# EAGLE design sanguino_better_644 (EAGLE 5.10)
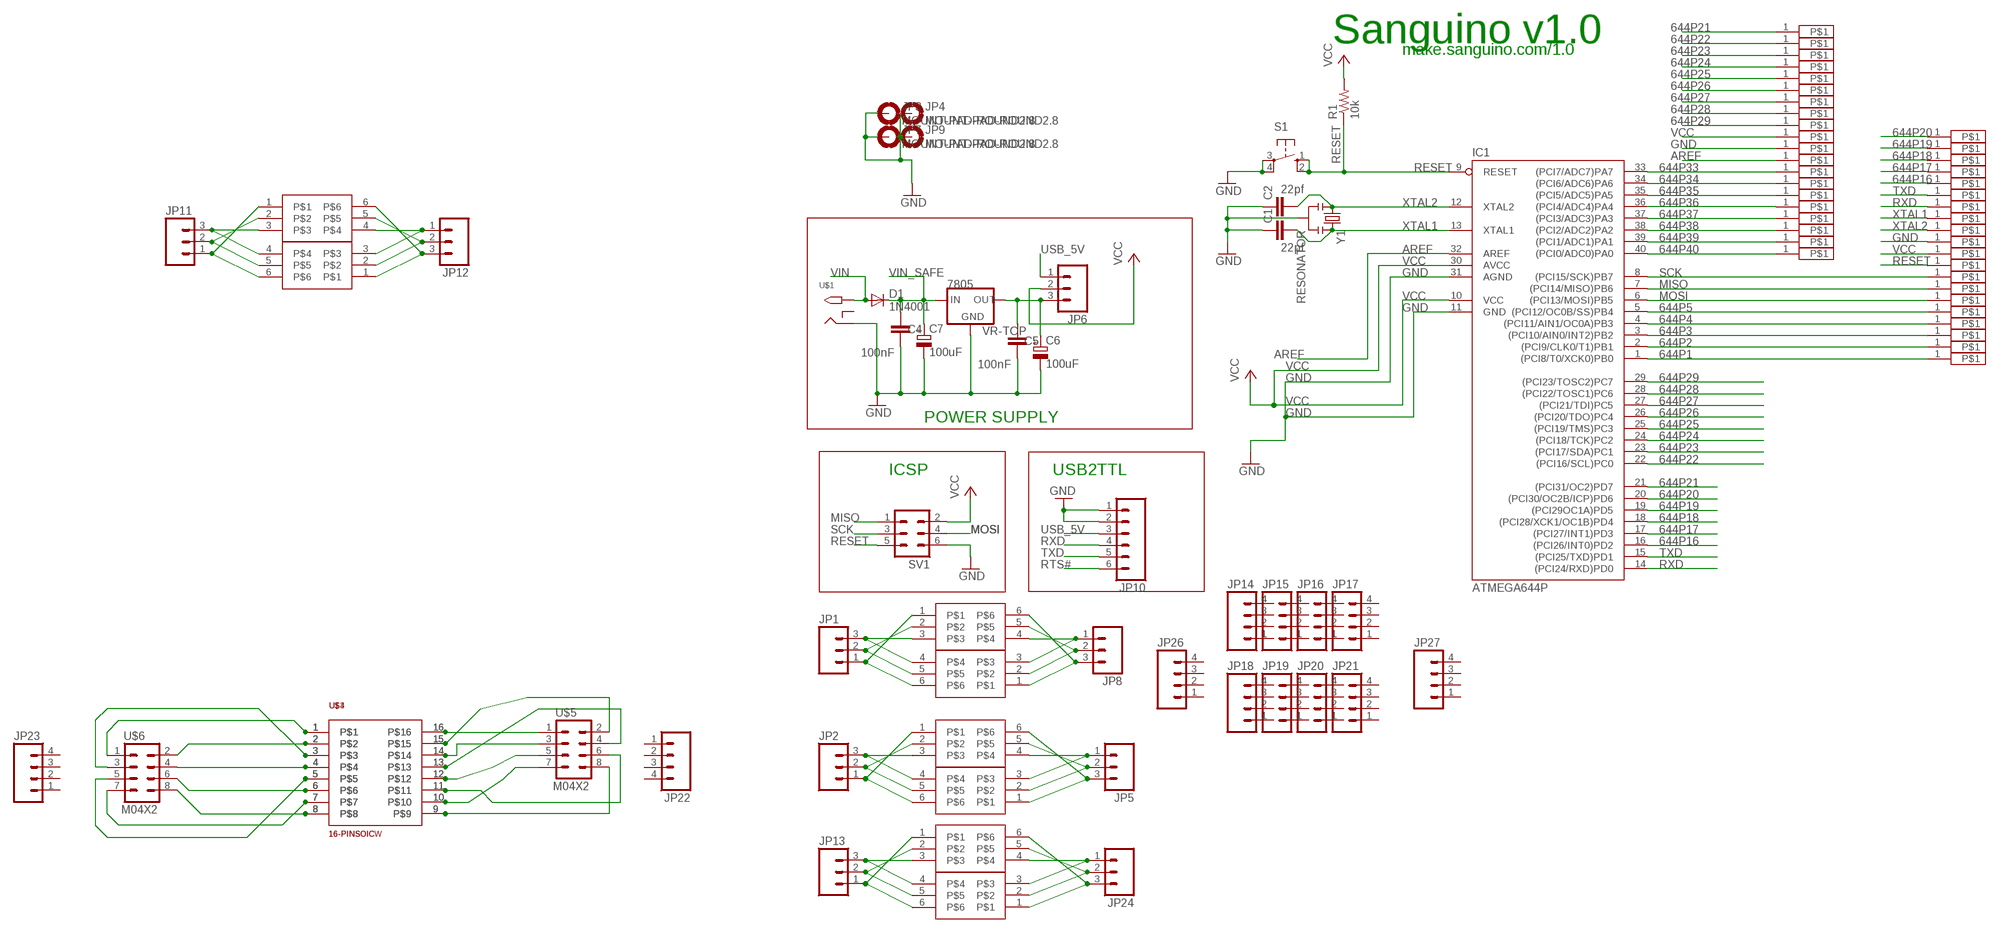
[diagram p0: schematic, sheet 1]

## Parts
C1  22pf  C-EU025-025X050  [C025-025X050]
C2  22pf  C-EU025-025X050  [C025-025X050]
C4  100nF  CAPPTH  [CAP-PTH-SMALL]
C5  100nF  CAPPTH  [CAP-PTH-SMALL]
C6  100uF  CPOL-EUE2.5-6  [E2,5-6]
C7  100uF  CPOL-EUE2.5-6  [E2,5-6]
D1  1N4001  1N4004  [DO41-10]
IC1  ATMEGA644P  ATMEGA644V-10P  [DIL40]
JP1  M03PTH  [1X03]
JP2  M03PTH  [1X03]
JP3  MOUNT-PAD-ROUND2.8  [2,8-PAD]
JP4  MOUNT-PAD-ROUND2.8  [2,8-PAD]
JP5  M03PTH  [1X03]
JP6  M03PTH  [1X03]
JP7  MOUNT-PAD-ROUND2.8  [2,8-PAD]
JP8  M03PTH  [1X03]
JP9  MOUNT-PAD-ROUND2.8  [2,8-PAD]
JP10  M06LOCK  [1X06_LOCK]
JP11  M03PTH  [1X03]
JP12  M03PTH  [1X03]
JP13  M03PTH  [1X03]
JP14  M04PTH  [1X04]
JP15  M04PTH  [1X04]
JP16  M04PTH  [1X04]
JP17  M04PTH  [1X04]
JP18  M04PTH  [1X04]
JP19  M04PTH  [1X04]
JP20  M04PTH  [1X04]
JP21  M04PTH  [1X04]
JP22  M04PTH  [1X04]
JP23  M04PTH  [1X04]
JP24  M03PTH  [1X03]
JP26  M04PTH  [1X04]
JP27  M04PTH  [1X04]
R1  10k  R-US_0207/2V  [0207/2V]
S1  10-XX  [B3F-10XX]
SV1  ML6  [ML6]
U$1  2.1MMJACKTHM  [PJ-102A]
U$2  3-PIN-STRIP  [1X03-STRIP]
U$3  16-PINSOICW  [SO16W]
U$4  16-PINSOIC  [SO16]
U$5  M04X2  [2X4]
U$6  M04X2  [2X4]
U$7  6-PINSOT23-6  [SOT23-6L]
U$8  6-PINSC70-6  [SC70-6L]
U$9  3-PIN-STRIP  [1X03-STRIP]
U$10  3-PIN-STRIP  [1X03-STRIP]
U$11  3-PIN-STRIP  [1X03-STRIP]
U$12  3-PIN-STRIP  [1X03-STRIP]
U$13  3-PIN-STRIP  [1X03-STRIP]
U$14  3-PIN-STRIP  [1X03-STRIP]
U$15  3-PIN-STRIP  [1X03-STRIP]
U$16  3-PIN-STRIP  [1X03-STRIP]
U$17  3-PIN-STRIP  [1X03-STRIP]
U$18  3-PIN-STRIP  [1X03-STRIP]
U$19  3-PIN-STRIP  [1X03-STRIP]
U$20  3-PIN-STRIP  [1X03-STRIP]
U$21  3-PIN-STRIP  [1X03-STRIP]
U$22  3-PIN-STRIP  [1X03-STRIP]
U$23  3-PIN-STRIP  [1X03-STRIP]
U$24  3-PIN-STRIP  [1X03-STRIP]
U$25  3-PIN-STRIP  [1X03-STRIP]
U$26  3-PIN-STRIP  [1X03-STRIP]
U$27  3-PIN-STRIP  [1X03-STRIP]
U$28  3-PIN-STRIP  [1X03-STRIP]
U$29  3-PIN-STRIP  [1X03-STRIP]
U$30  3-PIN-STRIP  [1X03-STRIP]
U$31  3-PIN-STRIP  [1X03-STRIP]
U$32  3-PIN-STRIP  [1X03-STRIP]
U$33  3-PIN-STRIP  [1X03-STRIP]
U$34  3-PIN-STRIP  [1X03-STRIP]
U$35  3-PIN-STRIP  [1X03-STRIP]
U$36  3-PIN-STRIP  [1X03-STRIP]
U$37  3-PIN-STRIP  [1X03-STRIP]
U$38  3-PIN-STRIP  [1X03-STRIP]
U$39  3-PIN-STRIP  [1X03-STRIP]
U$40  3-PIN-STRIP  [1X03-STRIP]
U$41  3-PIN-STRIP  [1X03-STRIP]
U$42  3-PIN-STRIP  [1X03-STRIP]
U$43  3-PIN-STRIP  [1X03-STRIP]
U$44  3-PIN-STRIP  [1X03-STRIP]
U$45  3-PIN-STRIP  [1X03-STRIP]
U$46  3-PIN-STRIP  [1X03-STRIP]
U$47  3-PIN-STRIP  [1X03-STRIP]
U$48  6-PINSOT23-6  [SOT23-6L]
U$49  6-PINSC70-6  [SC70-6L]
U$50  6-PINSC70-6  [SC70-6L]
U$51  6-PINSC70-6  [SC70-6L]
U$52  6-PINSOT23-6  [SOT23-6L]
U$53  6-PINSOT23-6  [SOT23-6L]
VR-TOP  7805  V_REG_78XXSINK  [TO220-IGO]
Y1  RESONATOR  [RESONATOR/CRYSTAL_COMBO]

## Nets
644P1: IC1.1((PCI8/T0/XCK0)PB0) U$47.1
644P2: IC1.2((PCI9/CLK0/T1)PB1) U$46.1
644P3: IC1.3((PCI10/AIN0/INT2)PB2) U$45.1
644P4: IC1.4((PCI11/AIN1/OC0A)PB3) U$44.1
644P5: IC1.5((PCI12/OC0B/SS)PB4) U$43.1
644P16: IC1.16((PCI26/INT0)PD2) U$32.1
644P17: IC1.17((PCI27/INT1)PD3) U$31.1
644P18: IC1.18((PCI28/XCK1/OC1B)PD4) U$30.1
644P19: IC1.19((PCI29OC1A)PD5) U$29.1
644P20: IC1.20((PCI30/OC2B/ICP)PD6) U$24.1
644P21: IC1.21((PCI31/OC2)PD7) U$28.1
644P22: IC1.22((PCI16/SCL)PC0) U$27.1
644P23: IC1.23((PCI17/SDA)PC1) U$26.1
644P24: IC1.24((PCI18/TCK)PC2) U$25.1
644P25: IC1.25((PCI19/TMS)PC3) U$23.1
644P26: IC1.26((PCI20/TDO)PC4) U$22.1
644P27: IC1.27((PCI21/TDI)PC5) U$21.1
644P28: IC1.28((PCI22/TOSC1)PC6) U$20.1
644P29: IC1.29((PCI23/TOSC2)PC7) U$19.1
644P33: IC1.33((PCI7/ADC7)PA7) U$15.1
644P34: IC1.34((PCI6/ADC6)PA6) U$14.1
644P35: IC1.35((PCI5/ADC5)PA5) U$13.1
644P36: IC1.36((PCI4/ADC4)PA4) U$12.1
644P37: IC1.37((PCI3/ADC3)PA3) U$10.1
644P38: IC1.38((PCI2/ADC2)PA2) U$11.1
644P39: IC1.39((PCI1/ADC1)PA1) U$9.1
644P40: IC1.40((PCI0/ADC0)PA0) U$2.1
AREF: IC1.32(AREF) U$16.1
GND: C1.1 C2.1 C4.2 C5.2 C6.- C7.- IC1.11(GND) IC1.31(AGND) JP3.B2,8(MOUNT) JP4.B2,8(MOUNT) JP7.B2,8(MOUNT) JP9.B2,8(MOUNT) JP10.1 JP10.2 S1.3(P) S1.4(P1) SV1.6 U$1.RING U$17.1 U$37.1 VR-TOP.GND Y1.2
MISO: IC1.7((PCI14/MISO)PB6) SV1.1 U$41.1
MOSI: IC1.6((PCI13/MOSI)PB5) SV1.4 U$42.1
N$1: JP1.3 U$8.4 U$49.3
N$2: JP1.2 U$8.5 U$49.2
N$3: JP1.1 U$8.6 U$49.1
N$4: JP2.3 U$7.3 U$48.4
N$5: JP2.2 U$7.2 U$48.5
N$6: JP2.1 U$7.1 U$48.6
N$7: JP5.1 U$7.4 U$48.3
N$8: JP5.2 U$7.5 U$48.2
N$9: JP5.3 U$7.6 U$48.1
N$10: JP8.1 U$8.3 U$49.4
N$11: U$3.16 U$4.16 U$5.1
N$12: U$3.15 U$4.15 U$5.2
N$13: JP8.2 U$8.2 U$49.5
N$14: U$3.5 U$4.5 U$6.5
N$15: U$3.1 U$4.1 U$6.1
N$16: JP8.3 U$8.1 U$49.6
N$17: JP11.3 U$50.4 U$51.3
N$18: JP11.2 U$50.5 U$51.2
N$19: JP11.1 U$50.6 U$51.1
N$20: JP12.1 U$50.3 U$51.4
N$21: U$3.14 U$4.14 U$5.3
N$22: U$3.13 U$4.13 U$5.4
N$23: U$3.12 U$4.12 U$5.5
N$24: U$3.11 U$4.11 U$5.6
N$25: U$3.10 U$4.10 U$5.7
N$26: U$3.9 U$4.9 U$5.8
N$27: U$3.8 U$4.8 U$6.8
N$28: U$3.7 U$4.7 U$6.7
N$29: U$3.6 U$4.6 U$6.6
N$30: JP12.2 U$50.2 U$51.5
N$31: U$3.4 U$4.4 U$6.4
N$32: U$3.3 U$4.3 U$6.3
N$33: U$3.2 U$4.2 U$6.2
N$34: JP12.3 U$50.1 U$51.6
N$35: JP13.3 U$52.3 U$53.4
N$36: JP13.2 U$52.2 U$53.5
N$37: JP13.1 U$52.1 U$53.6
N$38: JP24.1 U$52.4 U$53.3
N$39: JP24.2 U$52.5 U$53.2
N$40: JP24.3 U$52.6 U$53.1
RESET: IC1.9(RESET) R1.1 S1.1(S) S1.2(S1) SV1.5 U$39.1
RTS#: JP10.6
RXD: IC1.14((PCI24/RXD)PD0) JP10.4 U$34.1
SCK: IC1.8((PCI15/SCK)PB7) SV1.3 U$40.1
TXD: IC1.15((PCI25/TXD)PD1) JP10.5 U$33.1
USB_5V: JP6.1 JP10.3
VCC [power]: IC1.10(VCC) IC1.30(AVCC) JP6.2 R1.2 SV1.2 U$18.1 U$38.1
VIN [power]: D1.A U$1.TIP
VIN_SAFE [power]: C4.1 C7.+ D1.C VR-TOP.IN
VREG-OUT: C5.1 C6.+ JP6.3 VR-TOP.OUT
XTAL1: C1.2 IC1.13(XTAL1) U$35.1 Y1.3
XTAL2: C2.2 IC1.12(XTAL2) U$36.1 Y1.1
Unconnected: JP14.1 JP14.2 JP14.3 JP14.4 JP15.1 JP15.2 JP15.3 JP15.4 JP16.1 JP16.2 JP16.3 JP16.4 JP17.1 JP17.2 JP17.3 JP17.4 JP18.1 JP18.2 JP18.3 JP18.4 JP19.1 JP19.2 JP19.3 JP19.4 JP20.1 JP20.2 JP20.3 JP20.4 JP21.1 JP21.2 JP21.3 JP21.4 JP22.1 JP22.2 JP22.3 JP22.4 JP23.1 JP23.2 JP23.3 JP23.4 JP26.1 JP26.2 JP26.3 JP26.4 JP27.1 JP27.2 JP27.3 JP27.4 U$1.RING_SW

## Notes on the sheet
- Sanguino v1.0
- make.sanguino.com/1.0
- POWER SUPPLY
- ICSP | USB2TTL

## Library data of the parts
C1 C2 = rcl:C-EU: CAPACITOR, European symbol
C4 C5 = ideabot:CAP: Capacitor Standard 0603 ceramic capacitor, and 0.1" leaded capacitor.
C6 C7 = rcl:CPOL-EU: POLARIZED CAPACITOR, European symbol
D1 = diode:1N4004: DIODE general purpose rectifier, 1 A
IC1 = avr:ATMEGA644*P: MICROCONTROLLER 64 kBytes FLASH 4 kBytes SRAM 2 kBytes EEPROM DUAL USART 8-channel 10 bit ADC
JP1 JP2 JP5 JP6 JP8 JP11-JP13 JP24 = SparkFun:M03: Header 3 Standard 3-pin 0.1" header. Use with straight break away headers (SKU : PRT-00116), right angle break away headers (PRT-00553), swiss pins (PRT-00743), machine pins (PRT-00117), and female headers (PRT-00115). Molex polarized connector foot print use with SKU : PRT-08232 with associated crimp pins and housings.
JP3 JP4 JP7 JP9 = holes:MOUNT-PAD-ROUND: MOUNTING PAD, round
JP10 = SparkFun:M06: Header 6 Standard 6-pin 0.1" header. Use with straight break away headers (SKU : PRT-00116), right angle break away headers (PRT-00553), swiss pins (PRT-00743), machine pins (PRT-00117), and female headers (PRT-00115). Molex polarized connector foot print use with SKU : PRT-08094 with associated crimp pins and housings. NOTES ON THE VARIANTS LOCK and LOCK_LONGPADS... This footprint was designed to help hold the alignment of a through-hole component (i.e. 6-pin header) while soldering it into place. You may notice that each hole has been shifted either up or down by 0.005 of an inch from it's more standard position (which is a perfectly straight line). This slight alteration caused the pins (the squares in the middle) to touch the edges of the holes. Because they are alternating, it causes a "brace" to hold the component in place. 0.005 has proven to be the perfect amount of "off-center" position when using our standard breakaway headers. Although looks a little odd when you look at the bare footprint, once you have a header in there, the alteration is very hard to notice. Also, if you push a header all the way into place, it is covered up entirely on the bottom side. This idea of altering the position of holes to aid alignment will be further integrated into the Sparkfun Library for other footprints. It can help hold any component with 3 or more connection pins.
JP14-JP23 JP26 JP27 = SparkFun:M04: Header 4 Standard 4-pin 0.1" header. Use with straight break away headers (SKU : PRT-00116), right angle break away headers (PRT-00553), swiss pins (PRT-00743), machine pins (PRT-00117), and female headers (PRT-00115). Molex polarized connector foot print use with SKU : PRT-08231 with associated crimp pins and housings. 1MM SMD Version SKU: PRT-10208
R1 = adafruit:R-US_: RESISTOR, American symbol
S1 = switch-omron:10-XX: OMRON SWITCH
SV1 = con-harting-ml:ML6: HARTING
U$1 = adafruit:2.1MMJACK: 2.1mm x 5.5mm THM DC jack with internal switch. Digikey part #PJ-102A, 4UCON part #05537 2.1mm x 5.5mm SMT DC jack with internal switch. Digikey part #PJ-002A-SMT, 4UCON part #03267 By microbuilder.eu & adafruit.com
U$2 U$9-U$47 = ideabot:3-PIN-STRIP
U$3 U$4 = ideabot:16-PIN
U$5 U$6 = SparkFun:M04X2
U$7 U$8 U$48-U$53 = ideabot:6-PIN
VR-TOP = SparkFun:V_REG_78XX: Voltage Regulator Standard 7805 5V regulator. IGO (Input Ground Output). Spark Fun Electronics SKU : COM-00107
Y1 = ideabot:RESONATOR: Resonator Small SMD resonator. This is the itty bitty 10/20MHz resonators with built in caps. CSTCE10M0G55 and CSTCE20M0V53. Footprint has been reviewed closely but hasn't been tested yet.

## Net classes
0 default: width 0.254 mm, clearance 0.152 mm
1 power: width 0.305 mm, clearance 0.152 mm

## Board
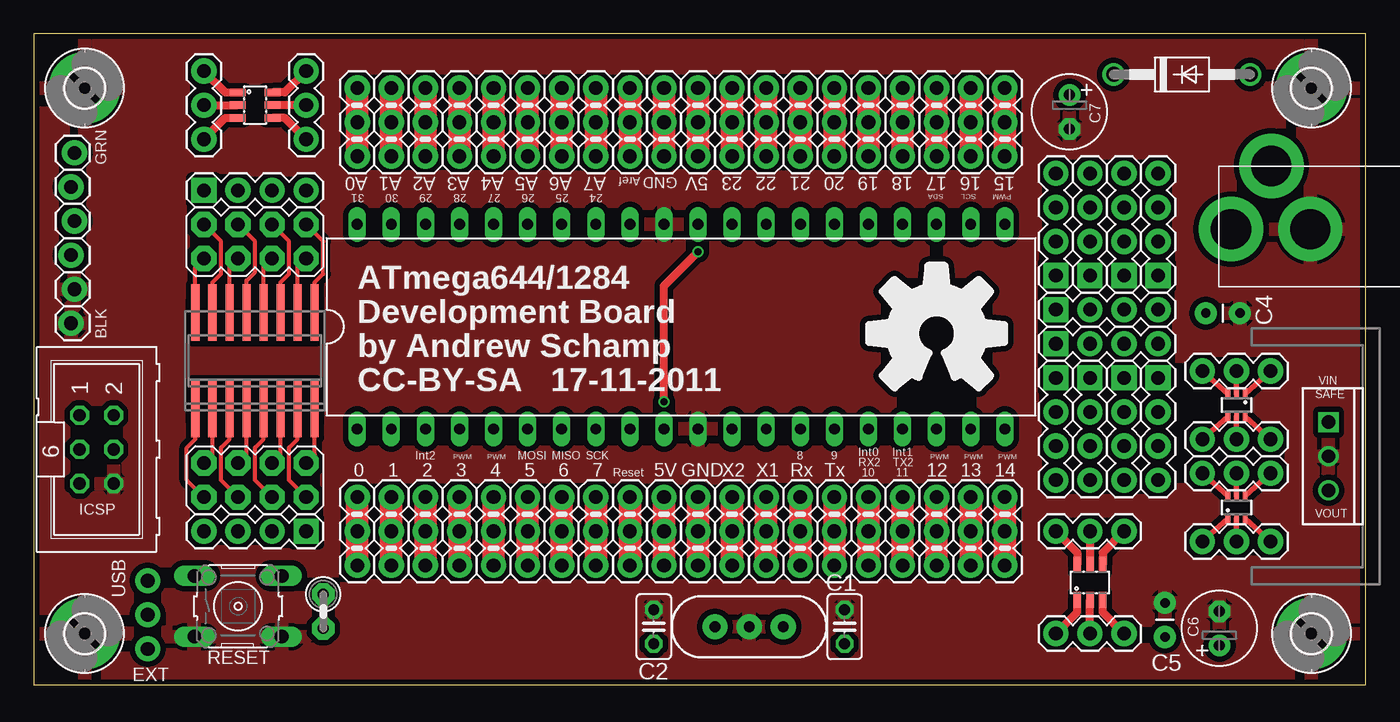
[diagram p1: board, top side]
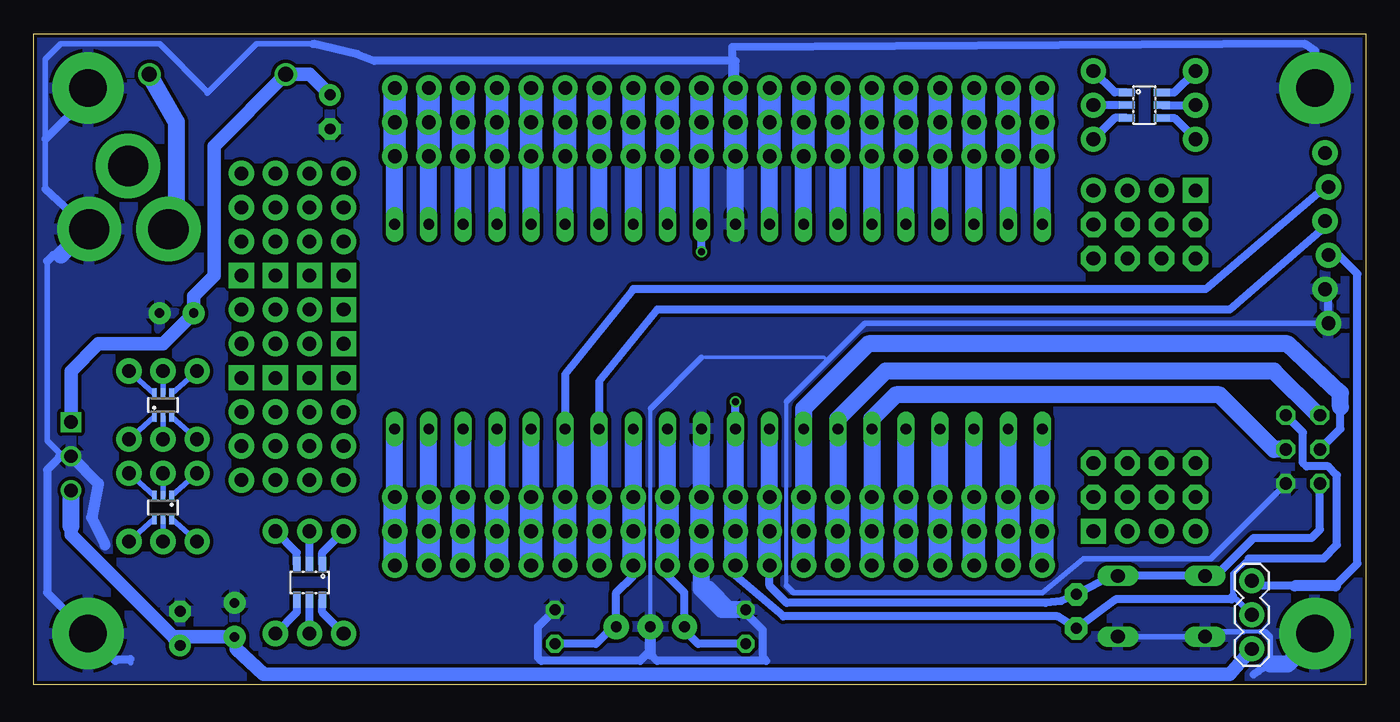
[diagram p2: board, bottom side, seen from below]

Size 99.31 x 48.51 mm. Coordinates in mm from the lower left corner, seen from the top.
Outline: 0,0 99.31,0 99.31,48.51 0,48.51 0,0
Copper layers (1*16): Top 0.035mm / dielectric 1.5mm / Bottom 0.035mm
Design rules "Fusion_eagle_rule_v1.1": minimum track width 6mil, minimum drill 12mil, track to track 6mil, track to pad 6mil, pad to pad 6mil, via to via 6mil, smd to smd 0mil, copper to edge 10mil, drill to drill 10mil, minimum pad ring 10mil, minimum via ring 6mil, stop-mask expansion 2mil, vias tented up to drill 100mil, thermal gap 10mil

### Footprints (pad centres in the part's own frame; a part is rotated, then mirrored left to right if it is on the bottom)
C025-025X050 = drill 0.813 octagon: 1 -1.27,0; 2 1.27,0
CAP-PTH-SMALL = drill 0.7 pad 1.651 round: 1 0,0; 2 2.54,0
E2,5-6 = drill 0.813 pad 1.6 round: + -1.27,0 | drill 0.813 pad 1.6 octagon: - 1.27,0
DO41-10 = drill 1.118 round: A 5.08,0; C -5.08,0
DIL40 = drill 0.813 long: 1 -24.13,-7.62; 2 -21.59,-7.62; 3 -19.05,-7.62; 4 -16.51,-7.62; 5 -13.97,-7.62; 6 -11.43,-7.62; 7 -8.89,-7.62; 8 -6.35,-7.62; 9 -3.81,-7.62; 10 -1.27,-7.62; 11 1.27,-7.62; 12 3.81,-7.62; 13 6.35,-7.62; 14 8.89,-7.62; 15 11.43,-7.62; 16 13.97,-7.62; 17 16.51,-7.62; 18 19.05,-7.62; 19 21.59,-7.62; 20 24.13,-7.62; 21 24.13,7.62; 22 21.59,7.62; 23 19.05,7.62; 24 16.51,7.62; 25 13.97,7.62; 26 11.43,7.62; 27 8.89,7.62; 28 6.35,7.62; 29 3.81,7.62; 30 1.27,7.62; 31 -1.27,7.62; 32 -3.81,7.62; 33 -6.35,7.62; 34 -8.89,7.62; 35 -11.43,7.62; 36 -13.97,7.62; 37 -16.51,7.62; 38 -19.05,7.62; 39 -21.59,7.62; 40 -24.13,7.62
1X03 = drill 1.016 pad 1.88 round: 1 0,0; 2 2.54,0; 3 5.08,0
2,8-PAD = drill 2.8 pad 5.334 round: B2,8 0,0
1X06_LOCK = drill 1.016 pad 1.88 round: 1 0,0; 2 2.54,-0.254; 3 5.08,0; 4 7.62,-0.254; 5 10.16,0; 6 12.7,-0.254
1X04 = drill 1.016 pad 1.88 square: 1 0,0 | drill 1.016 pad 1.88 round: 2 2.54,0; 3 5.08,0; 4 7.62,0
0207/2V = drill 0.813 pad 1.676 octagon: 1 -1.27,0; 2 1.27,0
B3F-10XX = drill 1.016 long: 1 -3.251,2.261; 2 3.251,2.261; 3 -3.251,-2.261; 4 3.251,-2.261
ML6 = drill 0.914 octagon: 1 -2.54,-1.27; 2 -2.54,1.27; 3 0,-1.27; 4 0,1.27; 5 2.54,-1.27; 6 2.54,1.27
PJ-102A = drill 3 pad 4.8 round: RING 0.1,-3.39; RING_SW -4.6,-6.29; TIP 0.1,-9.29
1X03-STRIP = drill 1.016 pad 1.88 round: 1 0,0; 2 2.54,0; 3 5.08,0
SO16W = smd 0.6 x 2.2: 1 -4.445,-4.6; 2 -3.175,-4.6; 3 -1.905,-4.6; 4 -0.635,-4.6; 5 0.635,-4.6; 6 1.905,-4.6; 7 3.175,-4.6; 8 4.445,-4.6; 9 4.445,4.6; 10 3.175,4.6; 11 1.905,4.6; 12 0.635,4.6; 13 -0.635,4.6; 14 -1.905,4.6; 15 -3.175,4.6; 16 -4.445,4.6
SO16 = smd 0.6 x 2.2: 1 -4.445,-2.6; 2 -3.175,-2.6; 3 -1.905,-2.6; 4 -0.635,-2.6; 5 0.635,-2.6; 6 1.905,-2.6; 7 3.175,-2.6; 8 4.445,-2.6; 9 4.445,2.6; 10 3.175,2.6; 11 1.905,2.6; 12 0.635,2.6; 13 -0.635,2.6; 14 -1.905,2.6; 15 -3.175,2.6; 16 -4.445,2.6
2X4 = drill 1.016 pad 1.88 octagon: 1 -3.81,-1.27; 2 -3.81,1.27; 3 -1.27,-1.27; 4 -1.27,1.27; 5 1.27,-1.27; 6 1.27,1.27; 7 3.81,-1.27; 8 3.81,1.27
SOT23-6L = smd 0.55 x 1.2: 1 -0.95,-1.3; 2 0,-1.3; 3 0.95,-1.3; 4 0.95,1.3; 5 0,1.3; 6 -0.95,1.3
SC70-6L = smd 0.35 x 0.8: 1 -0.65,-0.85; 2 0,-0.85; 3 0.65,-0.85; 4 0.65,0.85; 5 0,0.85; 6 -0.65,0.85
TO220-IGO = drill 1 round: GND 0,0; OUT 2.54,0 | drill 1 square: IN -2.54,0
RESONATOR/CRYSTAL_COMBO = drill 0.8 pad 1.88 round: 1 -2.54,0; 2 0,0; 3 2.54,0

### Placement (x,y rotation side)
C1  60.45,4.32 270 top
C2  46.23,4.32 270 top
C4  87.38,27.69 0 top
C5  84.33,3.56 90 top
C6  88.39,4.19 90 top
C7  77.22,42.67 270 top
D1  85.6,45.47 0 top
IC1  48.26,26.67 0 top
JP1  87.12,15.75 0 top
JP2  20.32,45.72 270 top
JP3  3.81,3.81 0 top
JP4  95.25,3.81 0 top
JP5  12.7,40.64 90 top
JP6  8.51,7.75 270 bottom
JP7  3.81,44.45 0 top
JP8  92.2,10.67 180 top
JP9  95.25,44.45 0 top
JP10  2.79,26.92 90 top
JP11  92.2,18.29 180 top
JP12  87.12,23.37 0 top
JP13  76.2,11.43 0 top
JP14  76.2,30.48 90 top
JP15  78.74,30.48 90 top
JP16  81.28,30.48 90 top
JP17  83.82,30.48 90 top
JP18  76.2,22.86 270 top
JP19  78.74,22.86 270 top
JP20  81.28,22.86 270 top
JP21  83.82,22.86 270 top
JP22  12.7,36.83 0 top
JP23  20.32,11.43 180 top
JP24  81.28,3.81 180 top
JP26  76.2,27.94 0 top
JP27  76.2,25.4 0 top
R1  21.59,5.46 270 top
S1  15.24,5.84 0 top
SV1  4.7,17.53 270 top
U$1  98.55,34.04 270 top
U$2  24.13,39.37 90 top
U$3  16.51,24.13 0 top
U$4  16.51,24.13 0 top
U$5  16.51,33.02 0 top
U$6  16.51,15.24 0 top
U$7  16.51,43.18 270 bottom
U$8  89.66,13.21 0 top
U$9  26.67,39.37 90 top
U$10  31.75,39.37 90 top
U$11  29.21,39.37 90 top
U$12  34.29,39.37 90 top
U$13  36.83,39.37 90 top
U$14  39.37,39.37 90 top
U$15  41.91,39.37 90 top
U$16  44.45,39.37 90 top
U$17  46.99,39.37 90 top
U$18  49.53,39.37 90 top
U$19  52.07,39.37 90 top
U$20  54.61,39.37 90 top
U$21  57.15,39.37 90 top
U$22  59.69,39.37 90 top
U$23  62.23,39.37 90 top
U$24  72.39,13.97 270 top
U$25  64.77,39.37 90 top
U$26  67.31,39.37 90 top
U$27  69.85,39.37 90 top
U$28  72.39,39.37 90 top
U$29  69.85,13.97 270 top
U$30  67.31,13.97 270 top
U$31  64.77,13.97 270 top
U$32  62.23,13.97 270 top
U$33  59.69,8.89 90 top
U$34  57.15,13.97 270 top
U$35  54.61,13.97 270 top
U$36  52.07,13.97 270 top
U$37  49.53,13.97 270 top
U$38  46.99,13.97 270 top
U$39  44.45,13.97 270 top
U$40  41.91,13.97 270 top
U$41  39.37,13.97 270 top
U$42  36.83,13.97 270 top
U$43  34.29,13.97 270 top
U$44  31.75,13.97 270 top
U$45  29.21,13.97 270 top
U$46  26.67,13.97 270 top
U$47  24.13,13.97 270 top
U$48  16.51,43.18 270 top
U$49  89.66,13.21 180 bottom
U$50  89.66,20.83 180 top
U$51  89.66,20.83 0 bottom
U$52  78.74,7.62 180 bottom
U$53  78.74,7.62 0 top
VR-TOP  96.52,17.02 270 top
Y1  53.34,4.32 0 top

### Tracks (layer width: path | path; a pad name or v marks a point on that pad's centre or on a via)
644P1
  Bottom 1.27: U$47.1 IC1.1
644P2
  Bottom 1.27: U$46.1 IC1.2
644P3
  Bottom 1.27: U$45.1 IC1.3
644P4
  Bottom 1.27: U$44.1 IC1.4
644P5
  Bottom 1.27: U$43.1 IC1.5
644P16
  Bottom 1.27: U$32.1 IC1.16
644P17
  Bottom 1.27: U$31.1 IC1.17
644P18
  Bottom 1.27: U$30.1 IC1.18
644P19
  Bottom 1.27: U$29.1 IC1.19
644P20
  Bottom 1.27: U$24.1 IC1.20
644P21
  Bottom 1.27: IC1.21 U$28.1
644P22
  Bottom 1.27: IC1.22 U$27.1
644P23
  Bottom 1.27: IC1.23 U$26.1
644P24
  Bottom 1.27: IC1.24 U$25.1
644P25
  Bottom 1.27: IC1.25 U$23.1
644P26
  Bottom 1.27: IC1.26 U$22.1
644P27
  Bottom 1.27: IC1.27 U$21.1
644P28
  Bottom 1.27: IC1.28 U$20.1
644P29
  Bottom 1.27: IC1.29 U$19.1
644P33
  Bottom 1.27: IC1.33 U$15.1
644P34
  Bottom 1.27: IC1.34 U$14.1
644P35
  Bottom 1.27: IC1.35 U$13.1
644P36
  Bottom 1.27: IC1.36 U$12.1
644P37
  Bottom 1.27: IC1.37 U$10.1
644P38
  Bottom 1.27: IC1.38 U$11.1
644P39
  Bottom 1.27: IC1.39 U$9.1
644P40
  Bottom 1.27: IC1.40 U$2.1
AREF
  Bottom 1.27: IC1.32 U$16.1
GND
  Bottom 0.254: 49.28,24.38 40.39,24.38 40.13,24.13
  Bottom 0.305: 7.87,3.94 9.14,3.94 | 43.18,7.37 43.18,21.08 | Y1.2 53.34,20.57
  Bottom 0.406: 8,1.02 7.11,1.4 7.11,1.52 7.11,3.56 7.49,3.94 7.87,3.94 | 9.14,3.94 11.63,3.94 S1.3 S1.4 | 92.08,1.91 92.08,1.65 | 97.16,17.02 97.41,17.02 | 97.16,17.02 VR-TOP.GND | 97.16,17.02 98.3,18.16 98.3,31.56 | 98.42,36.95 98.42,40.64 98.42,46.61 97.28,47.75 89.92,47.75 86.36,44.2 86.36,44.07 82.68,47.75 78.49,47.75 78.23,47.75 | JP10.1 37.34,26.92 40.13,24.13 43.18,21.08 | 43.18,7.37 42.67,6.86 24.13,6.86 21.08,9.4 11.56,9.4 SV1.6 | 53.34,20.57 49.53,24.38
  Bottom 0.61: 97.28,32 97.86,32 98.3,31.56 | 8,1.02 8.38,0.76 | 98.42,36.95 U$1.RING | 92.08,1.91 93.34,1.91 JP4.B2,8 | JP7.B2,8 3.81,47.24 4.57,47.75 47.24,47.5 47.24,44.7 | JP10.1 2.79,29.21 JP10.2 | U$17.1 46.99,46.48 73.91,46.48 75.18,46.99 78.49,47.75 | 97.41,17.02 97.41,16.89 98.3,16 98.3,6.86 JP4.B2,8 | JP4.B2,8 93.22,1.78 | JP9.B2,8 95.25,43.81 98.42,40.64 | C2.1 46.23,5.33 44.96,4.06 44.96,2.03 44.7,1.78 52.83,1.78 53.34,2.29 53.59,2.29 54.1,1.78 61.47,1.78 61.72,2.03 61.72,4.32 C1.1
  Bottom 0.813: 93.98,10.41 95,12.45 94.49,14.99 VR-TOP.GND | 53.34,2.29 Y1.2
  Bottom 1.27: JP3.B2,8 3.81,3.56 5.84,1.52 7.11,1.52 | U$1.RING 95.67,33.62 97.28,32 | IC1.31 U$17.1 | IC1.11 U$37.1 49.53,7.11 | 47.5,5.59 48.01,5.59 49.53,7.11 | 49.53,7.11 49.02,7.11 47.5,5.59 | C2.1 47.5,5.59
  pour Bottom (isolate 0.254): 0,48.26 -0.25,-0.25 99.57,-0.51 99.31,48.77
  pour Top (isolate 0.406): -0.25,48.51 -0.25,0.25 0.25,-0.25 99.57,-0.25 100.08,0.25 100.08,48.77 0,48.77
MISO
  Bottom 1.27: SV1.1 3.56,20.07 6.86,23.37 35.81,23.37 39.37,19.81 IC1.7 U$41.1
MOSI
  Bottom 1.27: SV1.4 6.86,17.53 10.92,21.59 35.05,21.59 36.83,19.81 IC1.6 U$42.1
N$1
  Top 0.406: JP1.3 U$49.3
  Bottom 0.406: U$49.3 JP1.3
N$2
  Top 0.406: JP1.2 U$49.2
  Bottom 0.406: U$49.2 JP1.2
N$3
  Top 0.406: JP1.1 U$49.1
  Bottom 0.406: U$49.1 JP1.1
N$4
  Top 0.61: U$7.3 18.73,42.23 JP2.3
  Bottom 0.61: U$7.3 18.73,42.23 JP2.3
N$5
  Top 0.61: JP2.2 U$7.2
  Bottom 0.61: U$7.2 JP2.2
N$6
  Top 0.61: U$7.1 18.73,44.13 JP2.1
  Bottom 0.61: U$7.1 18.73,44.13 JP2.1
N$7
  Top 0.61: U$7.4 14.29,42.23 JP5.1
  Bottom 0.61: U$7.4 14.29,42.23 JP5.1
N$8
  Top 0.61: JP5.2 U$7.5
  Bottom 0.61: U$7.5 JP5.2
N$9
  Top 0.61: U$7.6 14.29,44.13 JP5.3
  Bottom 0.61: U$7.6 14.29,44.13 JP5.3
N$10
  Top 0.406: JP8.1 U$49.4
  Bottom 0.406: U$49.4 JP8.1
N$11
  Top 0.305: U$5.1 12.06,31.11 U$3.16
  Top 0.61: U$4.16 U$3.16
N$12
  Top 0.305: U$3.15 13.34,29.97 13.97,30.61 13.97,33.02 U$5.2
  Top 0.61: U$4.15 U$3.15
N$13
  Top 0.406: JP8.2 U$49.5
  Bottom 0.406: U$49.5 JP8.2
N$14
  Top 0.305: U$3.5 17.14,18.29 16.51,17.65 16.51,15.24 U$6.5
  Top 0.61: U$3.5 U$4.5
N$15
  Top 0.305: U$3.1 12.06,18.29 11.43,17.65 11.43,15.24 U$6.1
  Top 0.61: U$3.1 U$4.1
N$16
  Top 0.406: JP8.3 U$49.6
  Bottom 0.406: JP8.3 U$49.6
N$17
  Top 0.406: JP11.3 U$51.3
  Bottom 0.406: JP11.3 U$51.3
N$18
  Top 0.406: JP11.2 U$51.2
  Bottom 0.406: U$51.2 JP11.2
N$19
  Top 0.406: JP11.1 U$51.1
  Bottom 0.406: U$51.1 JP11.1
N$20
  Top 0.406: JP12.1 U$51.4
  Bottom 0.406: U$51.4 JP12.1
N$21
  Top 0.305: U$3.14 14.61,31.11 U$5.3
  Top 0.61: U$4.14 U$3.14
N$22
  Top 0.305: U$5.4 16.51,33.02 16.51,30.73 15.88,30.1 U$3.13
  Top 0.61: U$4.13 U$3.13
N$23
  Top 0.305: U$3.12 17.14,31.11 U$5.5
  Top 0.61: U$4.12 U$3.12
N$24
  Top 0.305: U$5.6 19.05,33.02 19.05,30.61 18.41,29.97 U$3.11
  Top 0.61: U$4.11 U$3.11
N$25
  Top 0.305: U$3.10 19.68,31.11 U$5.7
  Top 0.61: U$4.10 U$3.10
N$26
  Top 0.305: U$5.8 21.59,33.02 21.59,30.61 20.95,29.97 U$3.9
  Top 0.61: U$4.9 U$3.9
N$27
  Top 0.305: U$3.8 20.95,17.14 U$6.8
  Top 0.61: U$3.8 U$4.8
N$28
  Top 0.305: U$3.7 19.68,18.29 19.05,17.65 19.05,15.24 U$6.7
  Top 0.61: U$3.7 U$4.7
N$29
  Top 0.305: U$3.6 18.41,17.14 U$6.6
  Top 0.61: U$3.6 U$4.6
N$30
  Top 0.406: JP12.2 U$51.5
  Bottom 0.406: U$51.5 JP12.2
N$31
  Top 0.305: U$3.4 15.88,17.14 U$6.4
  Top 0.61: U$3.4 U$4.4
N$32
  Top 0.305: U$3.3 14.61,18.29 13.97,17.65 13.97,15.24 U$6.3
  Top 0.61: U$3.3 U$4.3
N$33
  Top 0.305: U$3.2 13.34,17.14 U$6.2
  Top 0.61: U$3.2 U$4.2
N$34
  Top 0.406: JP12.3 U$51.6
  Bottom 0.406: U$51.6 JP12.3
N$35
  Top 0.61: U$52.3 79.69,9.84 JP13.3
  Bottom 0.61: U$52.3 79.69,9.84 JP13.3
N$36
  Top 0.61: JP13.2 U$52.2
  Bottom 0.61: U$52.2 JP13.2
N$37
  Top 0.61: U$52.1 77.79,9.84 JP13.1
  Bottom 0.61: U$52.1 77.79,9.84 JP13.1
N$38
  Top 0.61: U$52.4 79.69,5.4 JP24.1
  Bottom 0.61: U$52.4 79.69,5.4 JP24.1
N$39
  Top 0.61: JP24.2 U$52.5
  Bottom 0.61: JP24.2 U$52.5
N$40
  Top 0.61: U$52.6 77.79,5.4 JP24.3
  Bottom 0.61: U$52.6 77.79,5.4 JP24.3
N$41
  Top 0.61: 68.65,22.93 arc9 69.16,23.2 70.44,22.16 71.31,23.03 70.27,24.31 arc19 70.71,25.38 72.35,25.54 72.35,26.78 70.71,26.95 arc19 70.27,28.01 71.31,29.29 70.44,30.16 69.16,29.12 arc19 68.1,29.57 67.93,31.2 66.69,31.2 66.52,29.57 arc19 65.46,29.12 64.18,30.16 63.31,29.29 64.35,28.01 arc19 63.91,26.95 62.27,26.78 62.27,25.54 63.91,25.38 arc19 64.35,24.31 63.31,23.03 64.18,22.16 65.46,23.2 arc9 65.97,22.93 66.7,24.7 arc-68 65.72,26.16 arc-248 67.92,24.7 68.65,22.93
RESET
  Bottom 0.406: S1.2 18.95,8.1 | 11.2,8.1 S1.1
  Bottom 0.61: S1.1 S1.2 | 18.95,8.1 R1.1 22.73,6.22 23.88,6.1 43.18,6.1 44.45,7.37 U$39.1 | 11.2,8.1 8.38,10.92 4.06,10.92 3.43,11.56 SV1.5
  Bottom 1.27: U$39.1 IC1.9
RXD
  Bottom 0.61: JP10.4 2.79,34.29 10.16,27.94 52.83,27.94 57.15,22.61 IC1.14
  Bottom 1.27: IC1.14 U$34.1
SCK
  Bottom 0.61: 1.91,20.7 1.91,19.05 SV1.3
  Bottom 1.27: 1.91,20.7 1.91,21.72 5.84,25.4 37.08,25.4 41.91,20.57 IC1.8 U$40.1
TXD
  Bottom 0.406: 59.69,13.97 U$33.1
  Bottom 0.61: IC1.15 59.69,23.11 54.61,29.46 11.94,29.46 3.3,36.83 3.05,36.83 JP10.5
  Bottom 1.27: IC1.15 59.69,13.97
USB_5V
  Bottom 0.406: 8.13,7.37 JP6.1
  Bottom 0.61: 5.33,7.37 8.13,7.37 | 2.29,7.37 0.64,9.02 0.64,30.61 2.03,32 JP10.3
  Bottom 0.813: 2.29,7.37 5.33,7.37
VCC  (via drill 0.51)
  Top 0.61: v46.99,21.08 46.99,29.72 v49.53,32.26
  Bottom 0.406: 10.03,6.35 9.65,6.35 JP6.2 | 9.91,6.6 9.91,8.26 8.76,9.4
  Bottom 0.61: SV1.2 4.7,18.8 4.7,16.51 4.45,16.26 2.79,16.26 2.16,15.62 2.16,10.41 3.17,9.4 8.76,9.4 | 9.91,6.6 10.03,6.48 10.03,6.35 18.67,6.35 R1.2 22.99,5.08 43.43,5.08 46.99,8.13 U$38.1 | IC1.10 v46.99,21.08 | v49.53,32.26 49.53,34.04 | IC1.30 49.53,35.05
  Bottom 1.27: 49.53,34.04 IC1.30 | 49.53,35.05 U$18.1 | U$38.1 IC1.10
VIN
  Bottom 1.27: D1.A 88.65,41.91 88.65,35.06 U$1.TIP
VIN_SAFE
  Bottom 1.016: VR-TOP.IN 96.52,23.37 94.49,25.4 89.66,25.4 C4.1 87.38,28.96 85.85,30.48 85.85,40.13 D1.C 78.74,45.47 C7.+
VREG-OUT
  Bottom 1.016: JP6.3 10.16,0.76 82.17,0.76 84.2,2.67 84.2,2.92 C5.1 88.77,3.56 C6.+ 89.03,3.68 96.52,11.18 96.52,11.81
  Bottom 1.27: 96.52,11.81 VR-TOP.OUT
XTAL1
  Bottom 0.61: U$35.1 54.61,8.13 55.88,6.86 Y1.3 56.13,4.32 57.4,3.05 C1.2
  Bottom 1.27: U$35.1 IC1.13
XTAL2
  Bottom 0.61: U$36.1 52.07,8.13 50.8,6.86 Y1.1 50.8,4.06 49.78,3.05 C2.2
  Bottom 1.27: U$36.1 IC1.12

### Text on the board
tPlace: GRN | A0 | A1 | A2 | A3 | A4 | A5 | A6 | A7 | Aref | GND | 5V | 23 | 22 | 21 | 20 | 19 | 18 | 17 | 16 | 15 | 31 | 30 | 29 | 28 | 27 | 26 | 25 | 24 | SDA | SCL | PWM | ATmega644/1284 | Development Board | BLK | by Andrew Schamp | CC-BY-SA 17-11-2011 | VIN | SAFE | Int2 | PWM | PWM | MOSI | MISO | SCK | 8 | 9 | Int0 | Int1 | PWM | PWM | PWM | RX2 | TX2 | 11 | 0 | 1 | 2 | 3 | 4 | 5 | 6 | 7 | Reset | 5V | GND | X2 | X1 | Rx | Tx | 10 | 12 | 13 | 14 | ICSP | VOUT | USB | RESET | EXT